# Altium schematic sheet 17-RESET GENERATION.SchDoc
size 513 x 386 mm
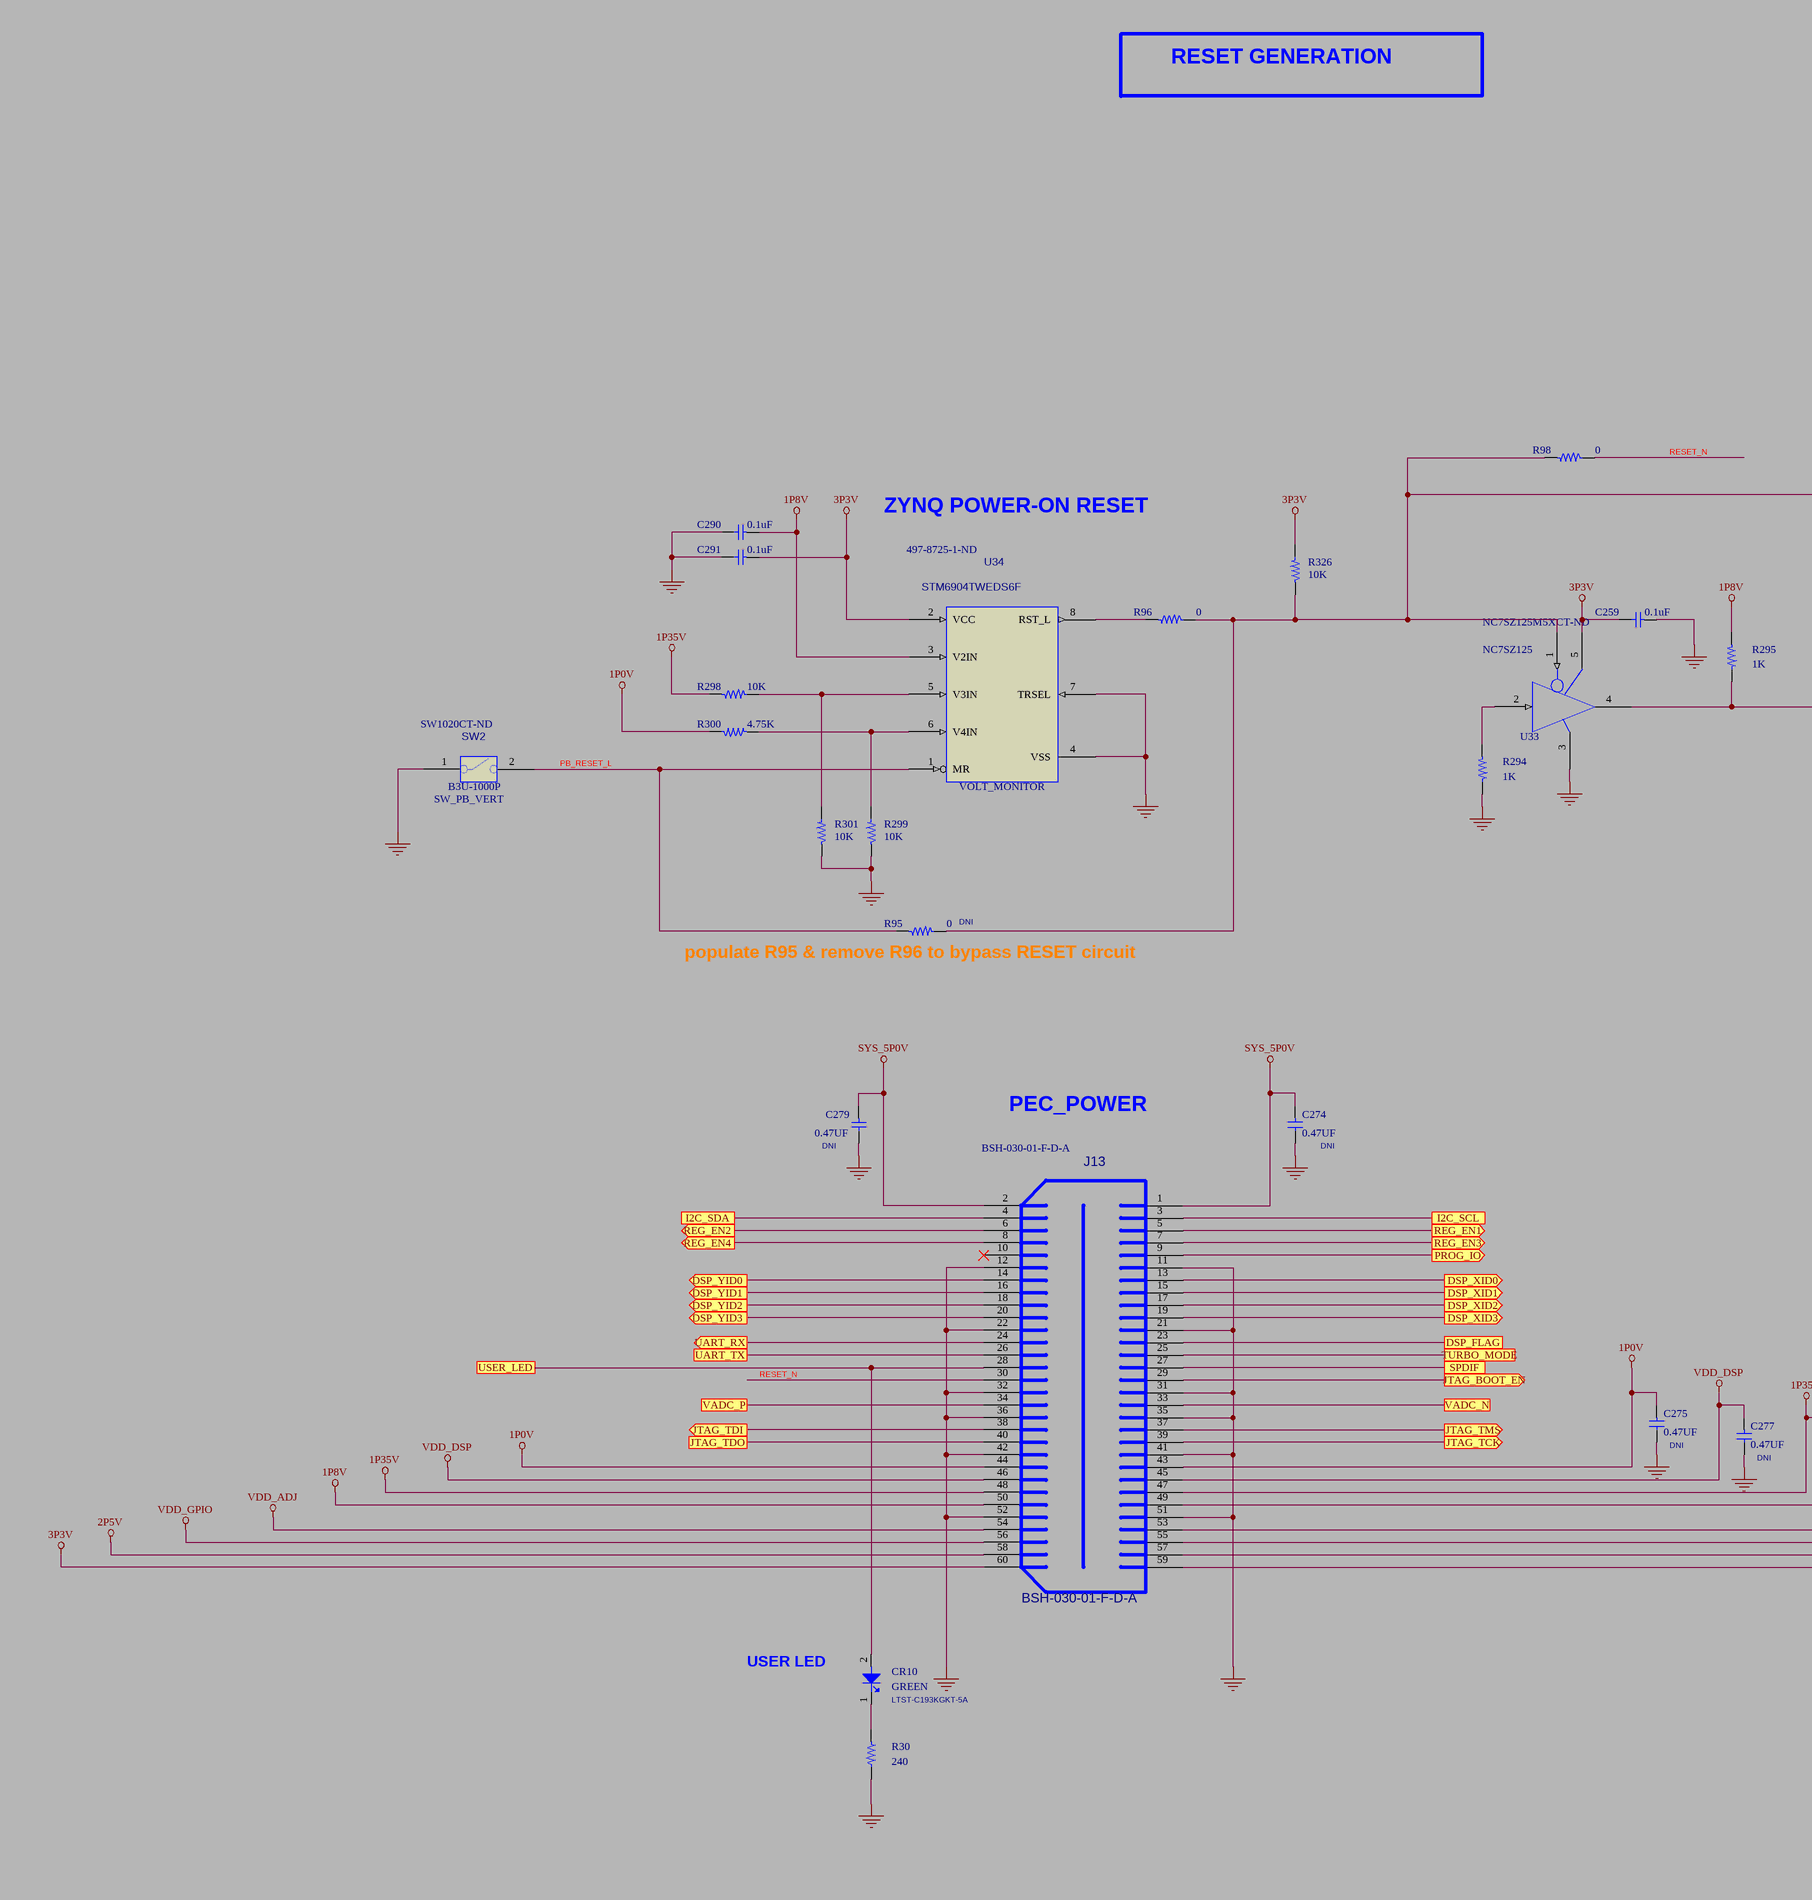
[diagram p0: 17-RESET GENERATION.SchDoc, left]
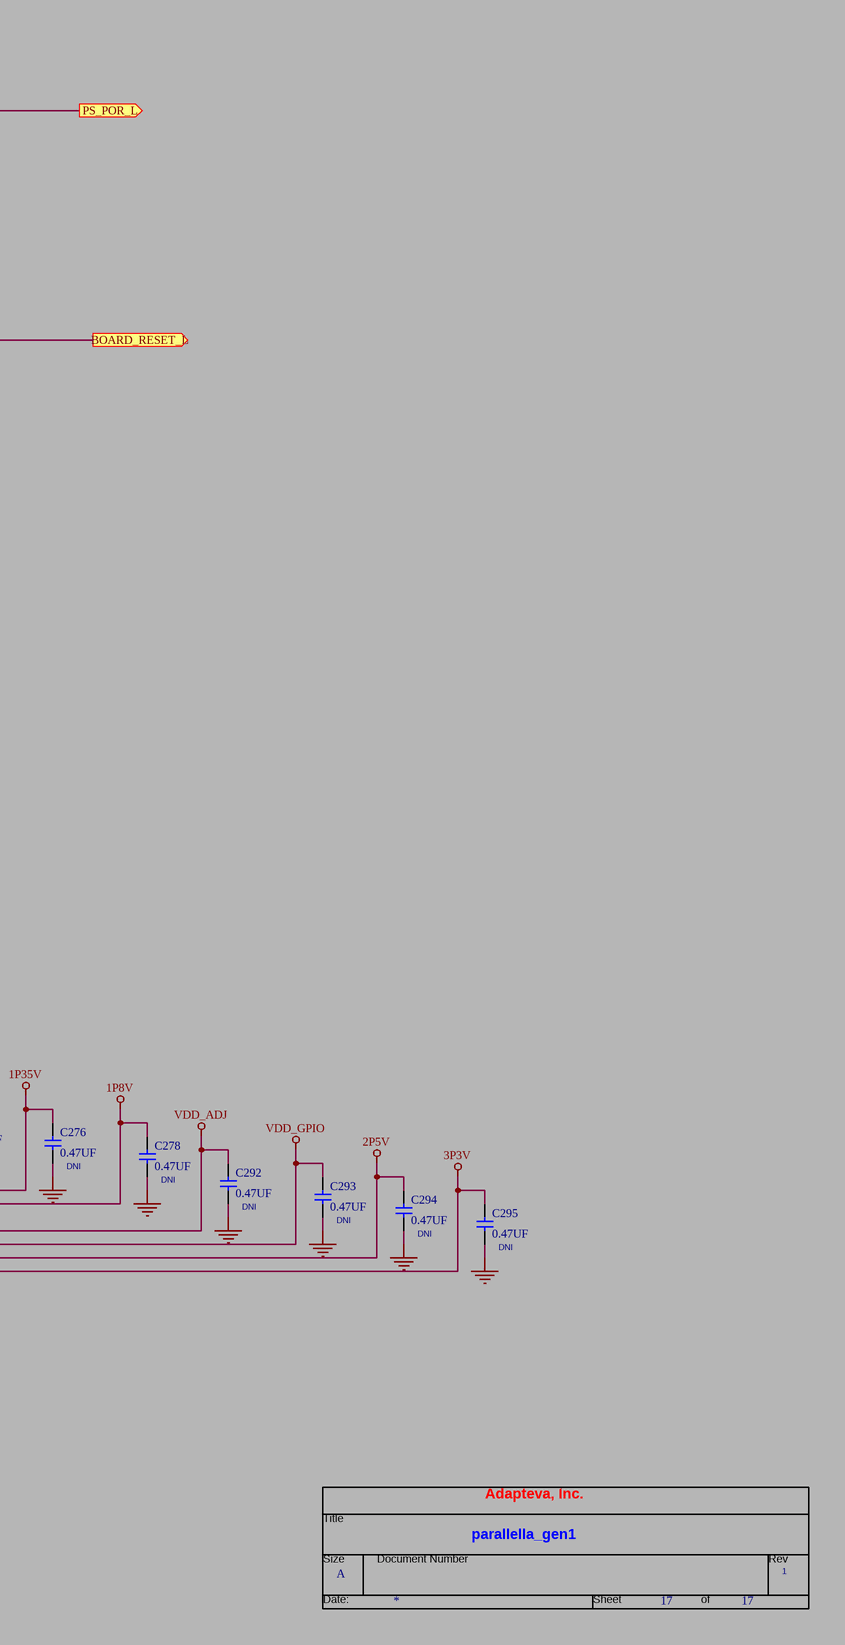
[diagram p1: 17-RESET GENERATION.SchDoc, right]

## Parts
*  RevCode: 1  Title: parallella_gen1  Page Size: A  Page Number: 17  OrgAddr1: Adapteva, Inc.  (hidden comment: TitleBlock0)  (graphical)
C259  0.1uF  [C0402]
C274  0.47UF  INSTALL: DNI  [C0402]
C275  0.47UF  INSTALL: DNI  [C0402]
C276  0.47UF  INSTALL: DNI  [C0402]
C277  0.47UF  INSTALL: DNI  [C0402]
C278  0.47UF  INSTALL: DNI  [C0402]
C279  0.47UF  INSTALL: DNI  [C0402]
C290  0.1uF  [C0402]
C291  0.1uF  [C0402]
C292  0.47UF  INSTALL: DNI  [C0402]
C293  0.47UF  INSTALL: DNI  [C0402]
C294  0.47UF  INSTALL: DNI  [C0402]
C295  0.47UF  INSTALL: DNI  [C0402]
CR10  GREEN  Vendor PN: LTST-C193KGKT-5A  [LED_0603]
J13  BSH-030-01-F-D-A  [CONN_BSH60P_13P59X25P88_P5P_V]
R30  240  [R0402]
R95  0  INSTALL: DNI  [R0402]
R96  0  [R0402]
R98  0  [R0402]
R294  1K  [R0402]
R295  1K  [R0402]
R298  10K  [R0402]
R299  10K  [R0402]
R300  4.75K  [R0402]
R301  10K  [R0402]
R326  10K  [R0402]
SW2  SW_PB_VERT  Vendor PN: B3U-1000P  Supplier Part Number 1: SW1020CT-ND  [SWITCH_2P5X4X1P6MMH]
U33  NC7SZ125  Supplier Part Number 1: NC7SZ125M5XCT-ND  [SOT_5PIN]
U34  VOLT_MONITOR  MFG PART NO: STM6904TWEDS6F  Supplier Part Number 1: 497-8725-1-ND  [TSSOP8_3SQX1P1H_P65P]

## Ports
BOARD_RESET_L (out), DSP_FLAG, DSP_XID0 (out), DSP_XID1 (out), DSP_XID2 (out), DSP_XID3 (out), DSP_YID0 (out), DSP_YID1 (out), DSP_YID2 (out), DSP_YID3 (out), I2C_SCL, I2C_SDA, JTAG_BOOT_EN (out), JTAG_TCK (out), JTAG_TDI (out), JTAG_TDO, JTAG_TMS (out), PROG_IO (out), PS_POR_L (out), REG_EN1 (out), REG_EN2 (out), REG_EN3 (out), REG_EN4 (out), SPDIF, TURBO_MODE, UART_RX (out), UART_TX, USER_LED, VADC_N, VADC_P

## Nets
1P0V: C275.1 J13.43 J13.44 R300.2
1P8V: C278.1 C290.1 J13.49 J13.50 R295.1 U34.3(V2IN)
1P35V: C276.1 J13.47 J13.48 R298.1
2P5V: C294.1 J13.57 J13.58
3P3V: C259.2 C291.1 C295.1 J13.59 J13.60 R326.2 U33.5(VCC) U34.2(VCC)
GND: C259.1 C274.2 C275.2 C276.2 C277.2 C278.2 C279.2 C290.2 C291.2 C292.2 C293.2 C294.2 C295.2 J13.11 J13.12 J13.21 J13.22 J13.31 J13.32 J13.35 J13.36 J13.41 J13.42 J13.51 J13.52 R30.2 R294.2 R299.1 R301.1 SW2.1(A) U33.3(GND) U34.4(VSS) U34.7(TRSEL)
SYS_5P0V: C274.1 C279.1 J13.1 J13.2
VDD_ADJ: C292.1 J13.53 J13.54
VDD_DSP: C277.1 J13.45 J13.46
VDD_GPIO: C293.1 J13.55 J13.56
BOARD_RESET_L: R295.2 U33.4(Y) ; port BOARD_RESET_L
DSP_FLAG: J13.23 ; port DSP_FLAG
DSP_XID0: J13.13 ; port DSP_XID0
DSP_XID1: J13.15 ; port DSP_XID1
DSP_XID2: J13.17 ; port DSP_XID2
DSP_XID3: J13.19 ; port DSP_XID3
DSP_YID0: J13.14 ; port DSP_YID0
DSP_YID1: J13.16 ; port DSP_YID1
DSP_YID2: J13.18 ; port DSP_YID2
DSP_YID3: J13.20 ; port DSP_YID3
I2C_SCL: J13.3 ; port I2C_SCL
I2C_SDA: J13.4 ; port I2C_SDA
JTAG_BOOT_EN: J13.29 ; port JTAG_BOOT_EN
JTAG_TCK: J13.39 ; port JTAG_TCK
JTAG_TDI: J13.38 ; port JTAG_TDI
JTAG_TDO: J13.40 ; port JTAG_TDO
JTAG_TMS: J13.37 ; port JTAG_TMS
PB_RESET_L: R95.1 SW2.2(B) U34.1(MR)
PROG_IO: J13.9 ; port PROG_IO
PS_POR_L: R95.2 R96.2 R98.1 R326.1 U33.1(~{OE}) ; port PS_POR_L
REG_EN1: J13.5 ; port REG_EN1
REG_EN2: J13.6 ; port REG_EN2
REG_EN3: J13.7 ; port REG_EN3
REG_EN4: J13.8 ; port REG_EN4
RESET_N: J13.30 R98.2
SPDIF: J13.27 ; port SPDIF
TURBO_MODE: J13.25 ; port TURBO_MODE
UART_RX: J13.24 ; port UART_RX
UART_TX: J13.26 ; port UART_TX
USER_LED: CR10.2(A) J13.28 ; port USER_LED
VADC_N: J13.33 ; port VADC_N
VADC_P: J13.34 ; port VADC_P
NetCR10_1: CR10.1(C) R30.1
NetR96_1: R96.1 U34.8(RST_L)
NetR294_1: R294.1 U33.2(A)
NetR298_2: R298.2 R301.2 U34.5(V3IN)
NetR299_2: R299.2 R300.1 U34.6(V4IN)

Not connected (* = marked no-connect by the designer): J13 10*

## Notes on the sheet
- RESET GENERATION
- ZYNQ POWER-ON RESET
- (near R95) populate R95 & remove R96 to bypass RESET circuit
- PEC_POWER
- USER LED
- (in symbol TitleBlock0) Title; Size; Document Number; Rev; Date:; Sheet; of

## Library data of the parts
C259 C290 C291 = CAP0402_0P1UF_X5R_35V: CAP, 0402, 0.1UF, X5R, 35V; ALT_SYMBOLS: C0402_BGA; Vendor PN: GMK105BJ104KV-F; Vendor: TAIYO YUDEN; DEVICE: CAP0402_0P1UF_X5R_35V; MFG PART NO: GMK105BJ104KV-F; MFG: TAIYO YUDEN; PCB Footprint: C0402
C274-C279 C292-C295 = CAP0402_0P47UF_X5R: CAP, 0402, 0.47UF, X5R, 16V; MFG PART NO: C1005X5R1C474K; MFG: TDK; ALT_SYMBOLS: C0402_BGA; DEVICE: CAP0402_0P47UF_X5R; Vendor: TDK; Vendor PN: C1005X5R1C474K; PCB Footprint: C0402
CR10 = LED_0603_5MA_GRN: LED, 0603, 5MA, SMT, GREEN; Voltage: 2V; MFG: LITE-ON INC; MFG PART NO: LTST-C193KGKT-5A; Vendor: LITE-ON INC; PCB Footprint: LED_0603
J13 = CON_BSH_030_VERT: Vendor: SAMTEC; Vendor PN: BSH-030-01-F-D-A; DEVICE: CON_BSH_030_VERT; PCB Footprint: CONN_BSH60P_13P59X25P88_P5P_V; Supplier 1: Arrow; Supplier Part Number 1: BSH-030-01-F-D-A
R30 = RES0402_240: RES, 0402, 240, 1%; MFG PART NO: CRCW0402240RFKED; ALT_SYMBOLS: R0402_BGA; MFG: VISHAY; Vendor: VISHAY/DALE; DEVICE: RES0402_240; Vendor PN: CRCW0402240RFKED; PCB Footprint: R0402
R95 R96 R98 = RES0402_0: RES, 0402, 0 OHM, 1%; MFG PART NO: CRCW04020000Z0ED; ALT_SYMBOLS: R0402_BGA; MFG: VISHAY; Vendor: VISHAY/DALE; DEVICE: RES0402_0; Vendor PN: CRCW04020000Z0ED; PCB Footprint: R0402
R294 R295 = RES0402_1K: RES, 0402, 1K; MFG PART NO: CRCW04021K00FKED; ALT_SYMBOLS: R0402_BGA; MFG: VISHAY; Vendor: VISHAY/DALE; DEVICE: RES0402_1K; Vendor PN: CRCW04021K00FKED; PCB Footprint: R0402
R298 R299 R301 R326 = RES0402_10K: RES, 0402, 10K; MFG PART NO: CRCW040210K0FKED; ALT_SYMBOLS: R0402_BGA; MFG: VISHAY; Vendor: VISHAY/DALE; DEVICE: RES0402_10K; Vendor PN: CRCW040210K0FKED; PCB Footprint: R0402
R300 = RES0402_4K75: RES, 0402, 4.75K, 1%; MFG PART NO: CRCW04024K75FKED; MFG: VISHAY; Vendor: VISHAY/DALE; ALT_SYMBOLS: R0402_BGA; DEVICE: RES0402_4K75; Vendor PN: CRCW04024K75FKED; PCB Footprint: R0402
SW2 = SW_PB_SPST_2PIN: SW, PUSHBUTTON, SPST, NORMALLY OPEN, SMT; Vendor: OMRON; DEVICE: SW_PB_SPST_2PIN; PCB Footprint: SWITCH_2P5X4X1P6MMH; Supplier 1: Digi-Key
U33 = NC7SZ125: PART_NUMBER: XXX-XXXXX-XX; Vendor PN: NC7SZ125M5X; VENDOR: FAIRCHILD; CLASS: IC; VENDOR_PN: NC7SZ125M5X; DEVICE: NC7SZ125; MFG: FAIRCHILD; MFG PART NO: NC7SZ125M5X; PCB Footprint: SOT_5PIN; Supplier 1: Digi-Key
U34 = VOLTMON_4IN_3P3: IC,  SUPPLY MONITOR, 4 INPUTS, TSSOP8; MFG: ST MICROELECTRONICS; DEVICE: VOLTMON_4IN_3P3; Vendor: ST MICROELECTRONICS; Vendor PN: STM6904TWEDS6F; PCB Footprint: TSSOP8_3SQX1P1H_P65P; Supplier 1: Digi-Key
* = TitleBlock0: Page Create Date: March  8, 1995; Page Count: 17; Page Modify Date: *